# EAGLE schematic schematic (EAGLE 9.2.0)
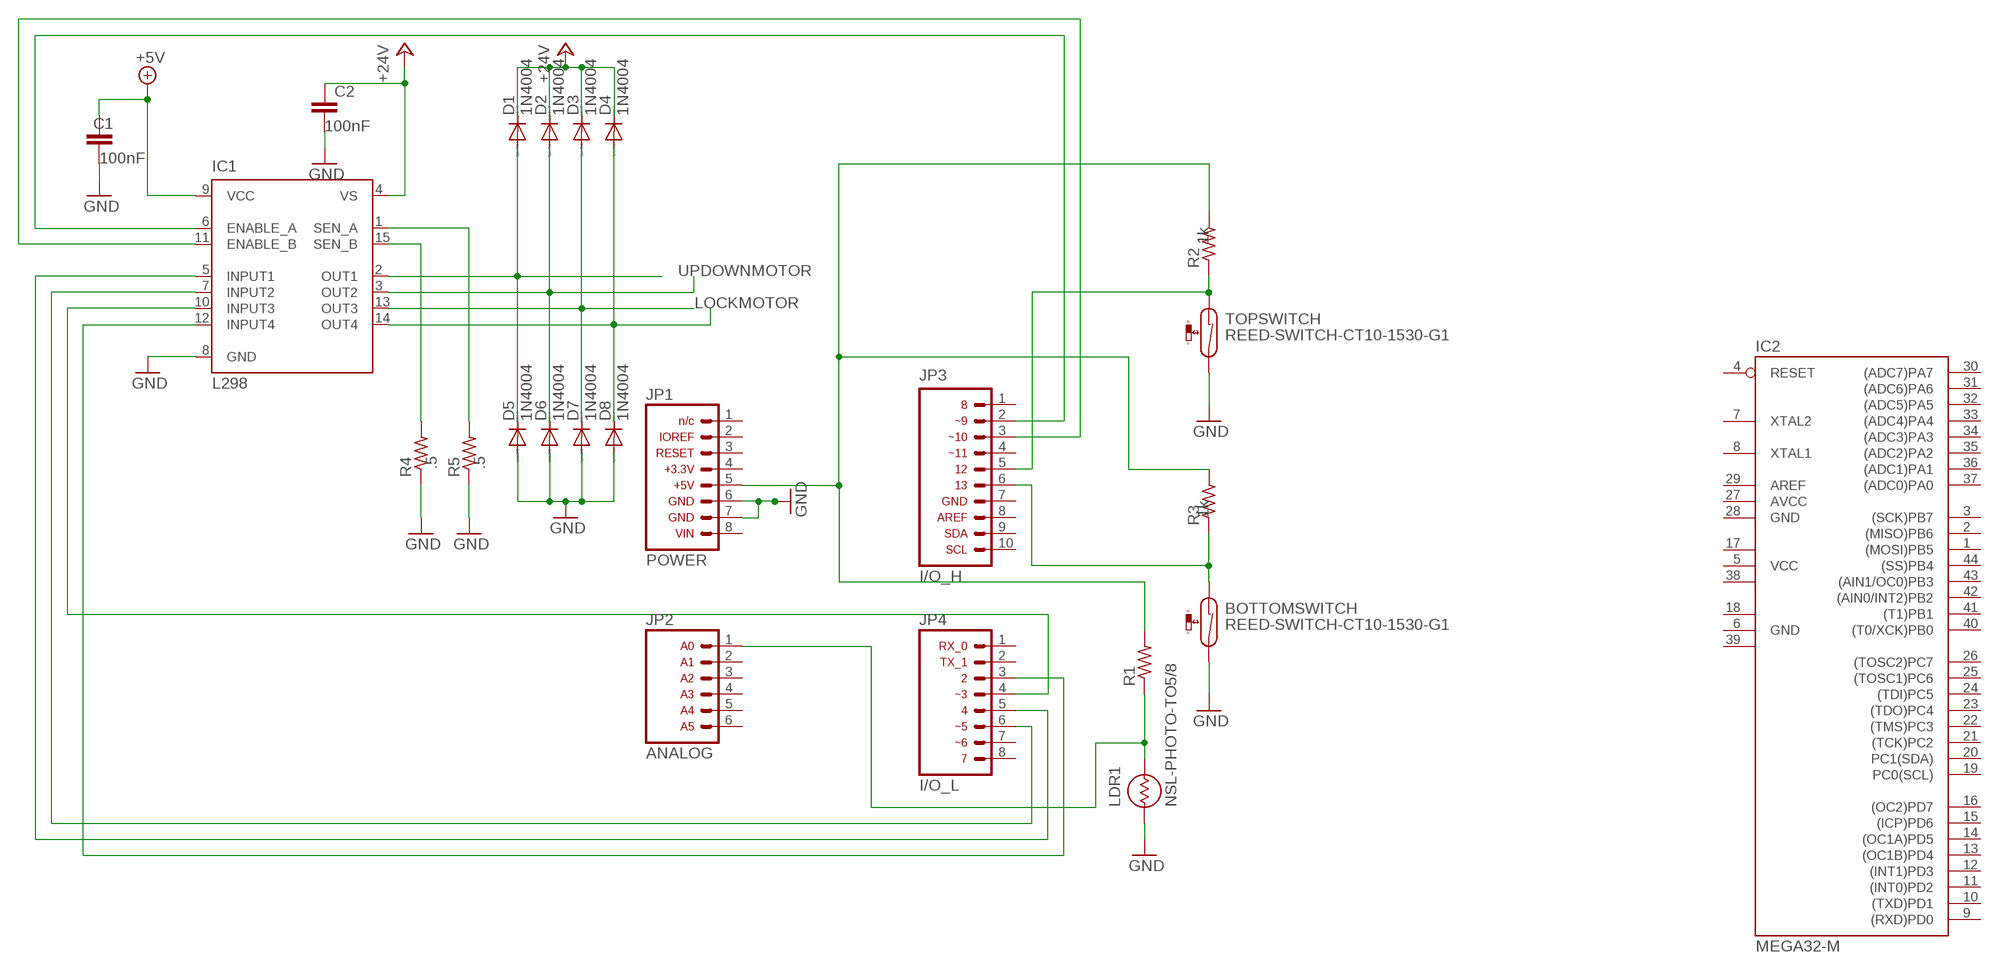
[diagram p0: schematic, sheet 1]

## Parts
BOTTOMSWITCH  REED-SWITCH-CT10-1530-G1  [CT10-G1]
C1  C2,5-3  [C2.5-3]
C2  C2,5-3  [C2.5-3]
D1  1N4004  [DO41-10]
D2  1N4004  [DO41-10]
D3  1N4004  [DO41-10]
D4  1N4004  [DO41-10]
D5  1N4004  [DO41-10]
D6  1N4004  [DO41-10]
D7  1N4004  [DO41-10]
D8  1N4004  [DO41-10]
IC1  L298  [MULTIWATT-15]
IC2  MEGA32-M  [MLF44]
JP1  ARDUINO_CONN-POWERSIP  [CONN-1X08]
JP2  ARDUINO_CONN-ANALOGSIP  [CONN-1X06]
JP3  ARDUINO_CONN-IO_HSIP  [CONN-1X10]
JP4  ARDUINO_CONN-IO_LSIP  [CONN-1X08]
LDR1  NSL-PHOTO-TO5/8  [NSL-TO5/8]
R1  R-US_0204/2V  [0204V]
R2  R-US_0204/2V  [0204V]
R3  R-US_0204/2V  [0204V]
R4  R-US_0204/2V  [0204V]
R5  R-US_0204/2V  [0204V]
TOPSWITCH  REED-SWITCH-CT10-1530-G1  [CT10-G1]

## Nets
+5V: C1.1 IC1.9(VCC)
+24V: C2.1 D1.C D2.C D3.C D4.C IC1.4(VS)
GND: BOTTOMSWITCH.2 C1.2 C2.2 D5.A D6.A D7.A D8.A IC1.8(GND) JP1.6 JP1.7 LDR1.2A R4.1 R5.1 TOPSWITCH.2
LOCKMOTOR: D3.A D7.C IC1.13(OUT3)
N$1: IC1.15(SEN_B) R4.2
N$2: JP1.5 R1.2 R2.2 R3.2
N$3: JP3.5 R2.1 TOPSWITCH.1
N$4: BOTTOMSWITCH.1 JP3.6 R3.1
N$5: IC1.5(INPUT1) JP4.5
N$6: IC1.7(INPUT2) JP4.6
N$7: IC1.6(ENABLE_A) JP3.2
N$8: D2.A D6.C IC1.3(OUT2)
N$9: JP2.1 LDR1.1A R1.1
N$10: D4.A D8.C IC1.14(OUT4)
N$11: IC1.11(ENABLE_B) JP3.3
N$12: IC1.10(INPUT3) JP4.4
N$13: IC1.12(INPUT4) JP4.3
N$14: IC1.1(SEN_A) R5.2
UPDOWNMOTOR: D1.A D5.C IC1.2(OUT1)
Unconnected: IC2.1((MOSI)PB5) IC2.2((MISO)PB6) IC2.3((SCK)PB7) IC2.4(RESET) IC2.7(XTAL2) IC2.8(XTAL1) IC2.9((RXD)PD0) IC2.10((TXD)PD1) IC2.11((INT0)PD2) IC2.12((INT1)PD3) IC2.13((OC1B)PD4) IC2.14((OC1A)PD5) IC2.15((ICP)PD6) IC2.16((OC2)PD7) IC2.19(PC0(SCL)) IC2.20(PC1(SDA)) IC2.21((TCK)PC2) IC2.22((TMS)PC3) IC2.23((TDO)PC4) IC2.24((TDI)PC5) IC2.25((TOSC1)PC6) IC2.26((TOSC2)PC7) IC2.29(AREF) IC2.30((ADC7)PA7) IC2.31((ADC6)PA6) IC2.32((ADC5)PA5) IC2.33((ADC4)PA4) IC2.34((ADC3)PA3) IC2.35((ADC2)PA2) IC2.36((ADC1)PA1) IC2.37((ADC0)PA0) IC2.40((T0/XCK)PB0) IC2.41((T1)PB1) IC2.42((AIN0/INT2)PB2) IC2.43((AIN1/OC0)PB3) IC2.44((SS)PB4) JP1.1 JP1.2 JP1.3 JP1.4 JP1.8 JP2.2 JP2.3 JP2.4 JP2.5 JP2.6 JP3.1 JP3.4 JP3.7 JP3.8 JP3.9 JP3.10 JP4.1 JP4.2 JP4.7 JP4.8

## Power pins joined to a net without a drawn wire
AVCC: IC2.27(AVCC)
GND: IC2.6(GND) IC2.28(GND)
GND1: IC2.18(GND1)
GND2: IC2.39(GND2)
VCC: IC2.5(VCC)
VCC1: IC2.17(VCC1)
VCC2: IC2.38(VCC2)

## Library data of the parts
BOTTOMSWITCH TOPSWITCH = switch-reed:REED-SWITCH-: Reed Sensor; MF: COTO TECHNOLOGY; MPN: CT10-1530-G1; OC_FARNELL: 1081696
C1 C2 = capacitor-wima:C: CAPACITOR naming: grid - package width; C1: 100nF
D1-D8 = diode:1N4004: DIODE general purpose rectifier, 1 A
IC1 = st-microelectronics:L298: DUAL FULL-BRIDGE DRIVER; MPN: L298N; OC_FARNELL: 1589425; OC_NEWARK: 32M1527
IC2 = atmel:MEGA32: MICROCONTROLLER 32 Kbytes FLASH 2 Kbytes SRAM 1 Kbytes EEPROM USART 8-channel 10 bit ADC Source: www.atmel.com .. doc2503.pdf; MPN: ATMEGA32-16MU; OC_FARNELL: 1455108; OC_NEWARK: 58M3733
JP1 = arduino_jw:ARDUINO_CONN-POWER: Arduino Power Header This is the power header on the Arduino Uno R3. This connector is labeled with the following pin assignments: n/c IO Ref RESET +3.3V +5V GND GND VIN NOTE: Be sure you install this connector with the correct orientation on your PCB layout. Pin 1 has a square pad to assist with orientation.
JP2 = arduino_jw:ARDUINO_CONN-ANALOG: Arduino Analog I/O Header This is the analog I/O header on the Arduino Uno R3. This connector is labeled with the following pin assignments: Analog 0 Analog 1 Analog 2 Analog 3 Analog 4 Analog 5 NOTE: Be sure you install this connector with the correct orientation on your PCB layout. Pin 1 has a square pad to assist with orientation.
JP3 = arduino_jw:ARDUINO_CONN-IO_H: Arduino Digital I/O [High Byte] Header This is the Digital I/O [high byte] header on the Arduino Uno R3. This connector is labeled with the following pin assignments: Digital 8 Digital 9 [PWM] Digital 10 [PWM] Digital 11 [PWM] Digital 12 Digital 13 GND AREF SDA SCL NOTE: Be sure you install this connector with the correct orientation on your PCB layout. Pin 1 has a square pad to assist with orientation.
JP4 = arduino_jw:ARDUINO_CONN-IO_L: Arduino Digital I/O [Low Byte] Header This is the Digital I/O [low byte] header on the Arduino Uno R3. This connector is labeled with the following pin assignments: Digital 0, Serial Rx Digital 1, Serial Tx Digital 2 Digital 4 Digital 5 [PWM] Digital 6 [PWM] Digital 7 NOTE: Be sure you install this connector with the correct orientation on your PCB layout. Pin 1 has a square pad to assist with orientation.
LDR1 = silonex:NSL-PHOTO-: PHOTOCELL NSL Series
R1 = rcl:R-US_: RESISTOR, American symbol; SPICEPREFIX: R
R2 R3 = rcl:R-US_: RESISTOR, American symbol; SPICEPREFIX: 1k
R4 R5 = rcl:R-US_: RESISTOR, American symbol; SPICEPREFIX: .5